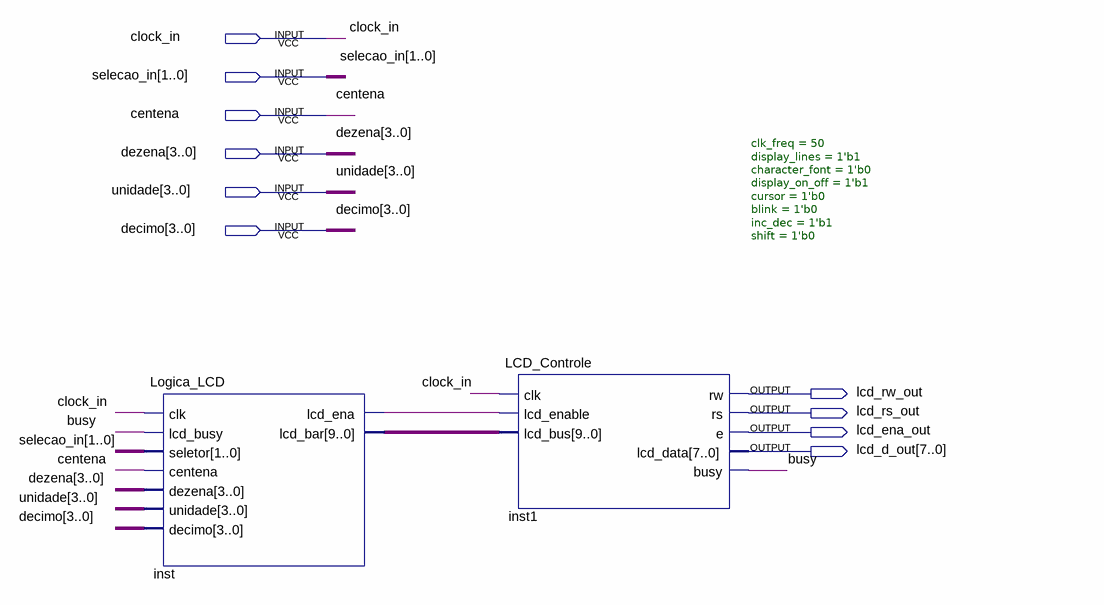
[diagram p0: schematic sheet]
// Quartus schematic Bloco_LCD.bdf as structural Verilog: 2 symbols, 10 pins
module Bloco_LCD (
  input  clock_in,
  input  [1:0] selecao_in,
  input  centena,
  input  [3:0] dezena,
  input  [3:0] unidade,
  input  [3:0] decimo,
  output lcd_rw_out,
  output lcd_rs_out,
  output lcd_ena_out,
  output [7:0] lcd_d_out
);

  wire busy, inst_lcd_ena;
  wire [9:0] inst_lcd_bar;

  Logica_LCD inst (
    .clk(clock_in), .lcd_busy(busy), .seletor(selecao_in), .centena(centena), .dezena(dezena),
    .unidade(unidade), .decimo(decimo), .lcd_ena(inst_lcd_ena), .lcd_bar(inst_lcd_bar));
  LCD_Controle #(.clk_freq(50), .display_lines(1'b1), .character_font(1'b0), .display_on_off(1'b1), .cursor(1'b0), .blink(1'b0), .inc_dec(1'b1), .shift(1'b0)) inst1 (
    .clk(clock_in), .lcd_enable(inst_lcd_ena), .lcd_bus(inst_lcd_bar), .rw(lcd_rw_out), .rs(lcd_rs_out),
    .e(lcd_ena_out), .lcd_data(lcd_d_out), .busy(busy));
endmodule
